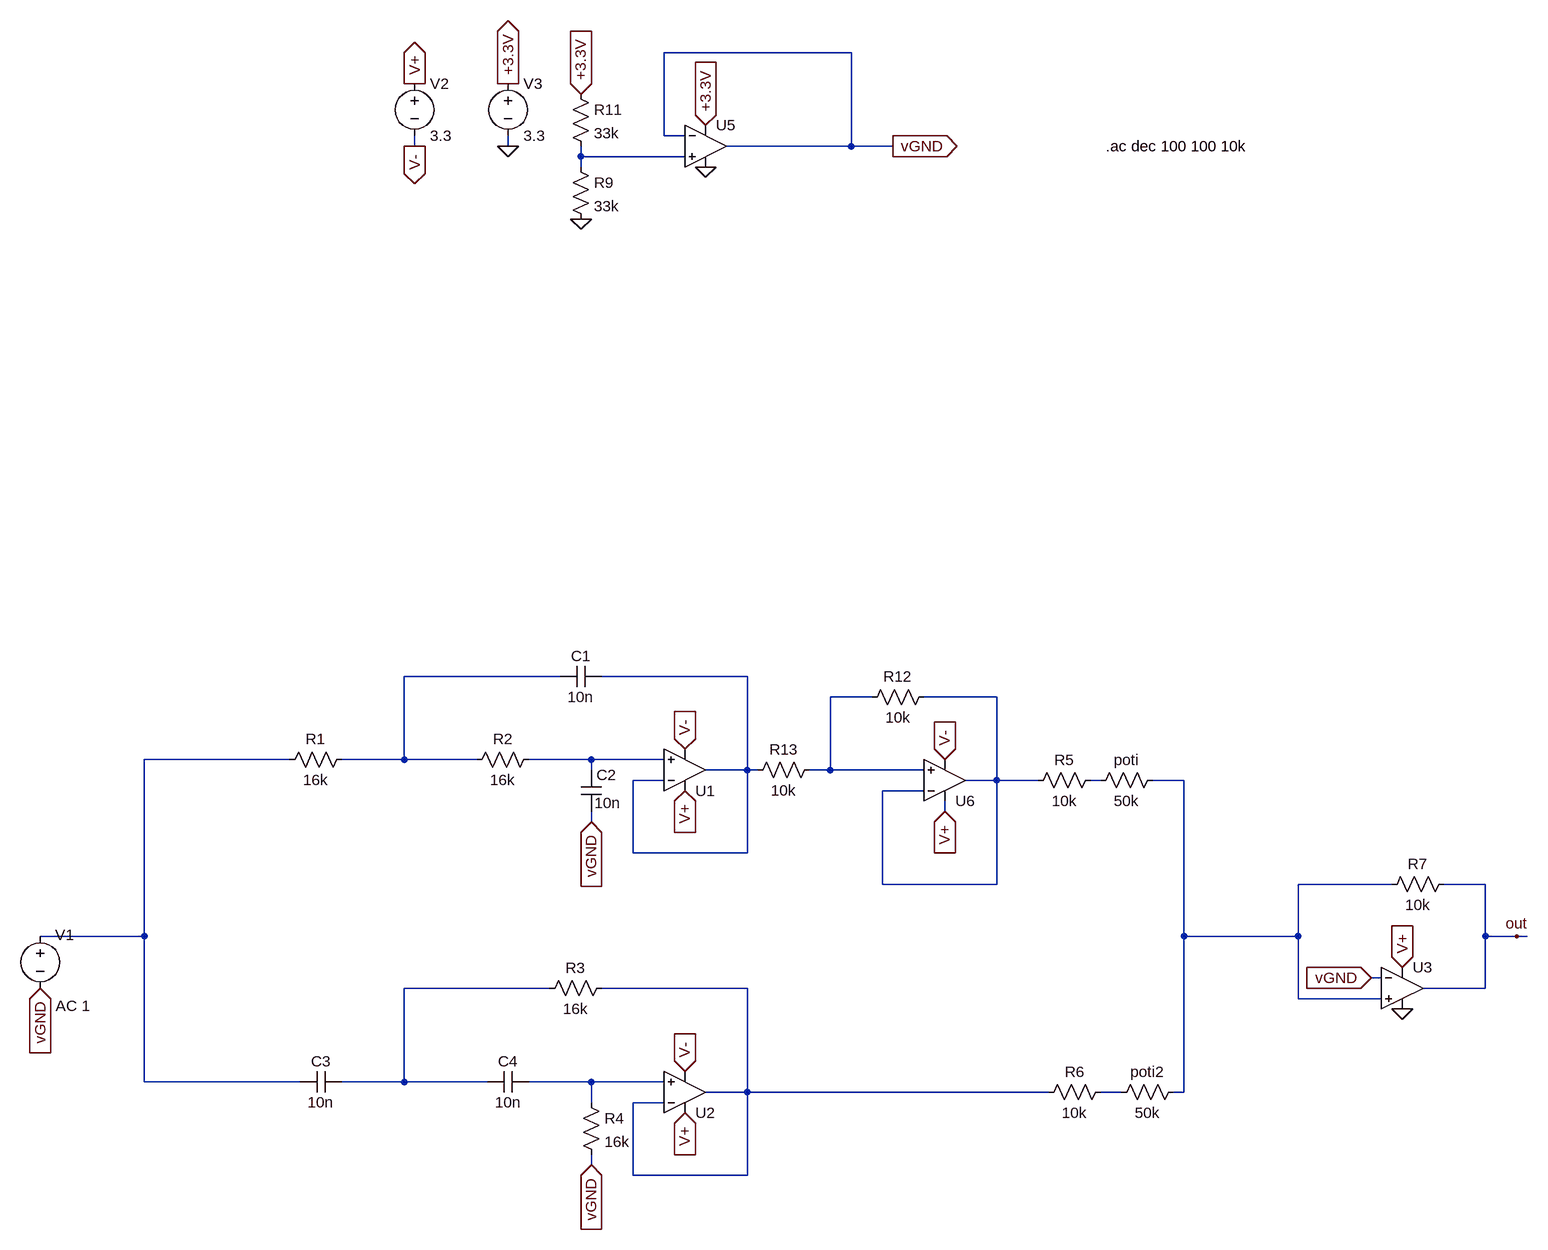
[diagram p0: schematic Addierer_mit_invertierer.asc]
Addierer_mit_invertierer.asc, the LTspice schematic file:
Version 4
SHEET 1 2372 844
WIRE 720 -1104 432 -1104
WIRE 432 -976 432 -1104
WIRE 464 -976 432 -976
WIRE 48 -960 48 -976
WIRE 192 -960 192 -976
WIRE 720 -960 720 -1104
WIRE 720 -960 528 -960
WIRE 784 -960 720 -960
WIRE 304 -944 304 -960
WIRE 464 -944 304 -944
WIRE 304 -928 304 -944
WIRE 272 -144 32 -144
WIRE 560 -144 336 -144
WIRE 752 -112 688 -112
WIRE 944 -112 832 -112
WIRE -144 -16 -368 -16
WIRE 32 -16 32 -144
WIRE 32 -16 -64 -16
WIRE 144 -16 32 -16
WIRE 320 -16 224 -16
WIRE 432 -16 320 -16
WIRE 320 0 320 -16
WIRE 560 0 560 -144
WIRE 560 0 496 0
WIRE 576 0 560 0
WIRE 688 0 688 -112
WIRE 688 0 656 0
WIRE 832 0 688 0
WIRE 432 16 384 16
WIRE 944 16 944 -112
WIRE 944 16 896 16
WIRE 1008 16 944 16
WIRE 1104 16 1088 16
WIRE 1232 16 1184 16
WIRE 832 32 768 32
WIRE 864 64 864 48
WIRE 320 80 320 64
WIRE 384 128 384 16
WIRE 560 128 560 0
WIRE 560 128 384 128
WIRE 768 176 768 32
WIRE 944 176 944 16
WIRE 944 176 768 176
WIRE 1552 176 1408 176
WIRE 1696 176 1632 176
WIRE -368 256 -368 -16
WIRE -368 256 -528 256
WIRE 1232 256 1232 16
WIRE 1408 256 1408 176
WIRE 1408 256 1232 256
WIRE 1696 256 1696 176
WIRE 1744 256 1696 256
WIRE 1760 256 1744 256
WIRE 1536 320 1520 320
WIRE 256 336 32 336
WIRE 560 336 336 336
WIRE 1696 336 1696 256
WIRE 1696 336 1600 336
WIRE 1408 352 1408 256
WIRE 1536 352 1408 352
WIRE -368 480 -368 256
WIRE -128 480 -368 480
WIRE 32 480 32 336
WIRE 32 480 -64 480
WIRE 160 480 32 480
WIRE 320 480 224 480
WIRE 432 480 320 480
WIRE 560 496 560 336
WIRE 560 496 496 496
WIRE 1024 496 560 496
WIRE 1136 496 1104 496
WIRE 1232 496 1232 256
WIRE 1232 496 1216 496
WIRE 320 512 320 480
WIRE 432 512 384 512
WIRE 320 608 320 592
WIRE 384 624 384 512
WIRE 560 624 560 496
WIRE 560 624 384 624
FLAG 48 -1056 V+
IOPIN 48 -1056 Out
FLAG 464 32 V+
IOPIN 464 32 In
FLAG 464 464 V-
IOPIN 464 464 In
FLAG 464 528 V+
IOPIN 464 528 In
FLAG 320 608 vGND
IOPIN 320 608 In
FLAG 192 -960 0
FLAG 192 -1056 +3.3V
IOPIN 192 -1056 Out
FLAG 304 -848 0
FLAG 304 -1040 +3.3V
IOPIN 304 -1040 In
FLAG 496 -928 0
FLAG 496 -992 +3.3V
IOPIN 496 -992 In
FLAG 784 -960 vGND
IOPIN 784 -960 Out
FLAG 1568 368 0
FLAG 1568 304 V+
IOPIN 1568 304 In
FLAG 1520 320 vGND
IOPIN 1520 320 In
FLAG 320 80 vGND
IOPIN 320 80 In
FLAG 864 64 V+
IOPIN 864 64 In
FLAG 48 -960 V-
IOPIN 48 -960 Out
FLAG 464 -32 V-
IOPIN 464 -32 In
FLAG 1744 256 out
FLAG -528 336 vGND
IOPIN -528 336 In
FLAG 864 -16 V-
IOPIN 864 -16 In
SYMBOL OpAmps\\UniversalOpamp2 464 0 M180
SYMATTR InstName U1
SYMATTR Value2 Avol=400k GBW=1Meg Slew=600k
SYMATTR SpiceLine Ilimit=20m Rail=25 Vos=0 phimargin=90
SYMATTR SpiceLine2 En=0 Enk=0 In=0 Ink=0 Rin=10T
SYMBOL voltage -528 240 R0
WINDOW 123 24 123 Left 2
WINDOW 39 0 0 Left 0
WINDOW 3 24 44 Left 2
WINDOW 0 23 14 Left 2
SYMATTR Value2 AC 1
SYMATTR Value ""
SYMATTR InstName V1
SYMBOL voltage 48 -1072 R0
SYMATTR InstName V2
SYMATTR Value 3.3
SYMBOL cap 336 -160 R90
WINDOW 0 0 32 VBottom 2
WINDOW 3 32 32 VTop 2
SYMATTR InstName C1
SYMATTR Value 10n
SYMBOL cap 304 0 R0
WINDOW 3 21 51 Left 2
SYMATTR Value 10n
SYMATTR InstName C2
SYMBOL res 128 0 R270
WINDOW 0 32 56 VTop 2
WINDOW 3 0 56 VBottom 2
SYMATTR InstName R2
SYMATTR Value 16k
SYMBOL res -48 -32 R90
WINDOW 0 0 56 VBottom 2
WINDOW 3 32 56 VTop 2
SYMATTR InstName R1
SYMATTR Value 16k
SYMBOL cap -64 464 R90
WINDOW 0 0 32 VBottom 2
WINDOW 3 32 32 VTop 2
SYMATTR InstName C3
SYMATTR Value 10n
SYMBOL cap 224 464 R90
WINDOW 0 0 32 VBottom 2
WINDOW 3 32 32 VTop 2
SYMATTR InstName C4
SYMATTR Value 10n
SYMBOL res 352 320 R90
WINDOW 0 0 56 VBottom 2
WINDOW 3 32 56 VTop 2
SYMATTR InstName R3
SYMATTR Value 16k
SYMBOL OpAmps\\UniversalOpamp2 464 496 M180
SYMATTR InstName U2
SYMATTR Value2 Avol=400k GBW=1Meg Slew=600k
SYMATTR SpiceLine Ilimit=20m Rail=25 Vos=0 phimargin=90
SYMATTR SpiceLine2 En=0 Enk=0 In=0 Ink=0 Rin=10T
SYMBOL res 304 496 R0
SYMATTR InstName R4
SYMATTR Value 16k
SYMBOL OpAmps\\UniversalOpamp2 496 -960 R0
SYMATTR InstName U5
SYMATTR Value2 Avol=400k GBW=1Meg Slew=600k
SYMATTR SpiceLine Ilimit=20m Rail=25 Vos=0 phimargin=90
SYMATTR SpiceLine2 En=0 Enk=0 In=0 Ink=0 Rin=10T
SYMBOL voltage 192 -1072 R0
SYMATTR InstName V3
SYMATTR Value 3.3
SYMBOL res 288 -944 R0
SYMATTR InstName R9
SYMATTR Value 33k
SYMBOL res 288 -1056 R0
SYMATTR InstName R11
SYMATTR Value 33k
SYMBOL OpAmps\\UniversalOpamp2 1568 336 R0
SYMATTR InstName U3
SYMATTR Value2 Avol=400k GBW=1Meg Slew=600k
SYMATTR SpiceLine Ilimit=20m Rail=25 Vos=0 phimargin=90
SYMATTR SpiceLine2 En=0 Enk=0 In=0 Ink=0 Rin=10T
SYMBOL res 1648 160 R90
WINDOW 0 0 56 VBottom 2
WINDOW 3 32 56 VTop 2
SYMATTR InstName R7
SYMATTR Value 10k
SYMBOL res 1200 0 R90
WINDOW 0 0 56 VBottom 2
WINDOW 3 32 56 VTop 2
SYMATTR InstName poti
SYMATTR Value 50k
SYMBOL res 1232 480 R90
WINDOW 0 0 56 VBottom 2
WINDOW 3 32 56 VTop 2
SYMATTR InstName poti2
SYMATTR Value 50k
SYMBOL OpAmps\\UniversalOpamp2 864 16 M180
SYMATTR InstName U6
SYMATTR Value2 Avol=400k GBW=1Meg Slew=600k
SYMATTR SpiceLine Ilimit=20m Rail=25 Vos=0 phimargin=90
SYMATTR SpiceLine2 En=0 Enk=0 In=0 Ink=0 Rin=10T
SYMBOL res 1104 0 R90
WINDOW 0 0 56 VBottom 2
WINDOW 3 32 56 VTop 2
SYMATTR InstName R5
SYMATTR Value 10k
SYMBOL res 1120 480 R90
WINDOW 0 0 56 VBottom 2
WINDOW 3 32 56 VTop 2
SYMATTR InstName R6
SYMATTR Value 10k
SYMBOL res 848 -128 R90
WINDOW 0 0 56 VBottom 2
WINDOW 3 32 56 VTop 2
SYMATTR InstName R12
SYMATTR Value 10k
SYMBOL res 672 -16 R90
WINDOW 0 0 56 VBottom 2
WINDOW 3 32 56 VTop 2
SYMATTR InstName R13
SYMATTR Value 10k
TEXT 1112 -960 Left 2 !.ac dec 100 100 10k

The netlist it stands for:
* Addierer_mit_invertierer.asc
XU1 N007 N003 V+ V- N003 level.2 Avol=400k GBW=1Meg Slew=600k Ilimit=20m Rail=25 Vos=0 phimargin=90 En=0 Enk=0 In=0 Ink=0 Rin=10T  ; pins IN+ IN- V+ V- OUT
V1 N006 vGND AC 1
V2 V+ V- 3.3
C1 N003 N002 10n
C2 N007 vGND 10n
R2 N002 N007 16k
R1 N002 N006 16k
C3 N010 N006 10n
C4 N012 N010 10n
R3 N011 N010 16k
XU2 N012 N011 V+ V- N011 level.2 Avol=400k GBW=1Meg Slew=600k Ilimit=20m Rail=25 Vos=0 phimargin=90 En=0 Enk=0 In=0 Ink=0 Rin=10T  ; pins IN+ IN- V+ V- OUT
R4 N012 vGND 16k
XU5 N001 vGND +3.3V 0 vGND level.2 Avol=400k GBW=1Meg Slew=600k Ilimit=20m Rail=25 Vos=0 phimargin=90 En=0 Enk=0 In=0 Ink=0 Rin=10T  ; pins IN+ IN- V+ V- OUT
V3 +3.3V 0 3.3
R9 N001 0 33k
R11 +3.3V N001 33k
XU3 N009 vGND V+ 0 out level.2 Avol=400k GBW=1Meg Slew=600k Ilimit=20m Rail=25 Vos=0 phimargin=90 En=0 Enk=0 In=0 Ink=0 Rin=10T  ; pins IN+ IN- V+ V- OUT
R7 out N009 10k
R§poti N009 N008 50k
R§poti2 N009 N013 50k
XU6 N004 N005 V+ V- N005 level.2 Avol=400k GBW=1Meg Slew=600k Ilimit=20m Rail=25 Vos=0 phimargin=90 En=0 Enk=0 In=0 Ink=0 Rin=10T  ; pins IN+ IN- V+ V- OUT
R5 N008 N005 10k
R6 N013 N011 10k
R12 N005 N004 10k
R13 N004 N003 10k
.ac dec 100 100 10k
.lib UniversalOpamps2.sub
.backanno
.end